# EAGLE schematic class ab (EAGLE 9.6.2)
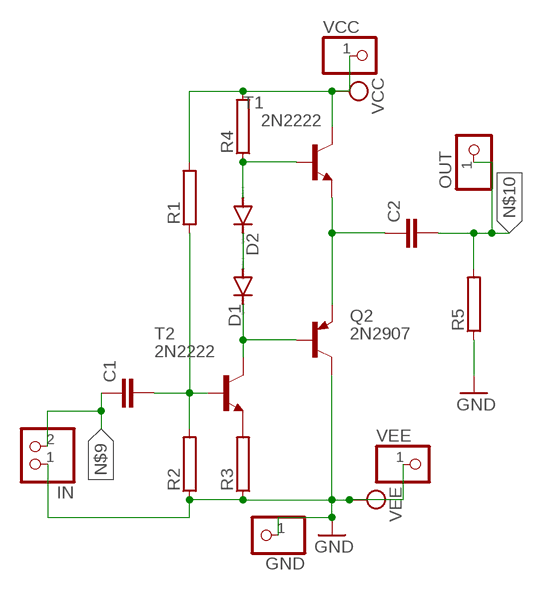
[diagram p0: schematic, sheet 1]

## Parts
C1  C2,5-3  [C2.5-3]
C2  C2,5-3  [C2.5-3]
D1  1N4148DO35-7  [DO35-7]
D2  1N4148DO35-7  [DO35-7]
GND  PINHD-1X1  [1X01]
IN  PINHD-1X2  [1X02]
OUT  PINHD-1X1  [1X01]
Q2  2N2907  [TO18]
R1  RAC01  [AC01]
R2  RAC01  [AC01]
R3  RAC01  [AC01]
R4  RAC01  [AC01]
R5  RAC01  [AC01]
T1  2N2222  [TO18]
T2  2N2222  [TO18]
VCC  PINHD-1X1  [1X01]
VEE  PINHD-1X1  [1X01]

## Nets
GND: GND.1 IN.1 Q2.3(C) R2.1 R3.1 R5.1 VEE.1 ; supply symbol labelled VEE
N$1: C1.2 R1.1 R2.2 T2.2(B)
N$2: D1.C Q2.2(B) T2.3(C)
N$3: D1.A D2.C
N$4: D2.A R4.1 T1.2(B)
N$5: R3.2 T2.1(E)
N$8: C2.1 Q2.1(E) T1.1(E)
N$9: C1.1 IN.2
N$10: C2.2 OUT.1 R5.2
VCC: R1.2 R4.2 T1.3(C) VCC.1

## Library data of the parts
C1 C2 = capacitor-wima:C: CAPACITOR naming: grid - package width
D1 D2 = diode:1N4148: DIODE high speed (Philips)
GND OUT VCC VEE = pinhead:PINHD-1X1: PIN HEADER
IN = pinhead:PINHD-1X2: PIN HEADER
Q2 = transistor-pnp:2N2907*: PNP Transistor
R1-R5 = resistor-power:R: Power Resitor; OC_FARNELL: unknown; OC_NEWARK: unknown
T1 T2 = transistor:2N2222: NPN TRANSISTOR